# EAGLE design sensor-t (EAGLE 6.2)
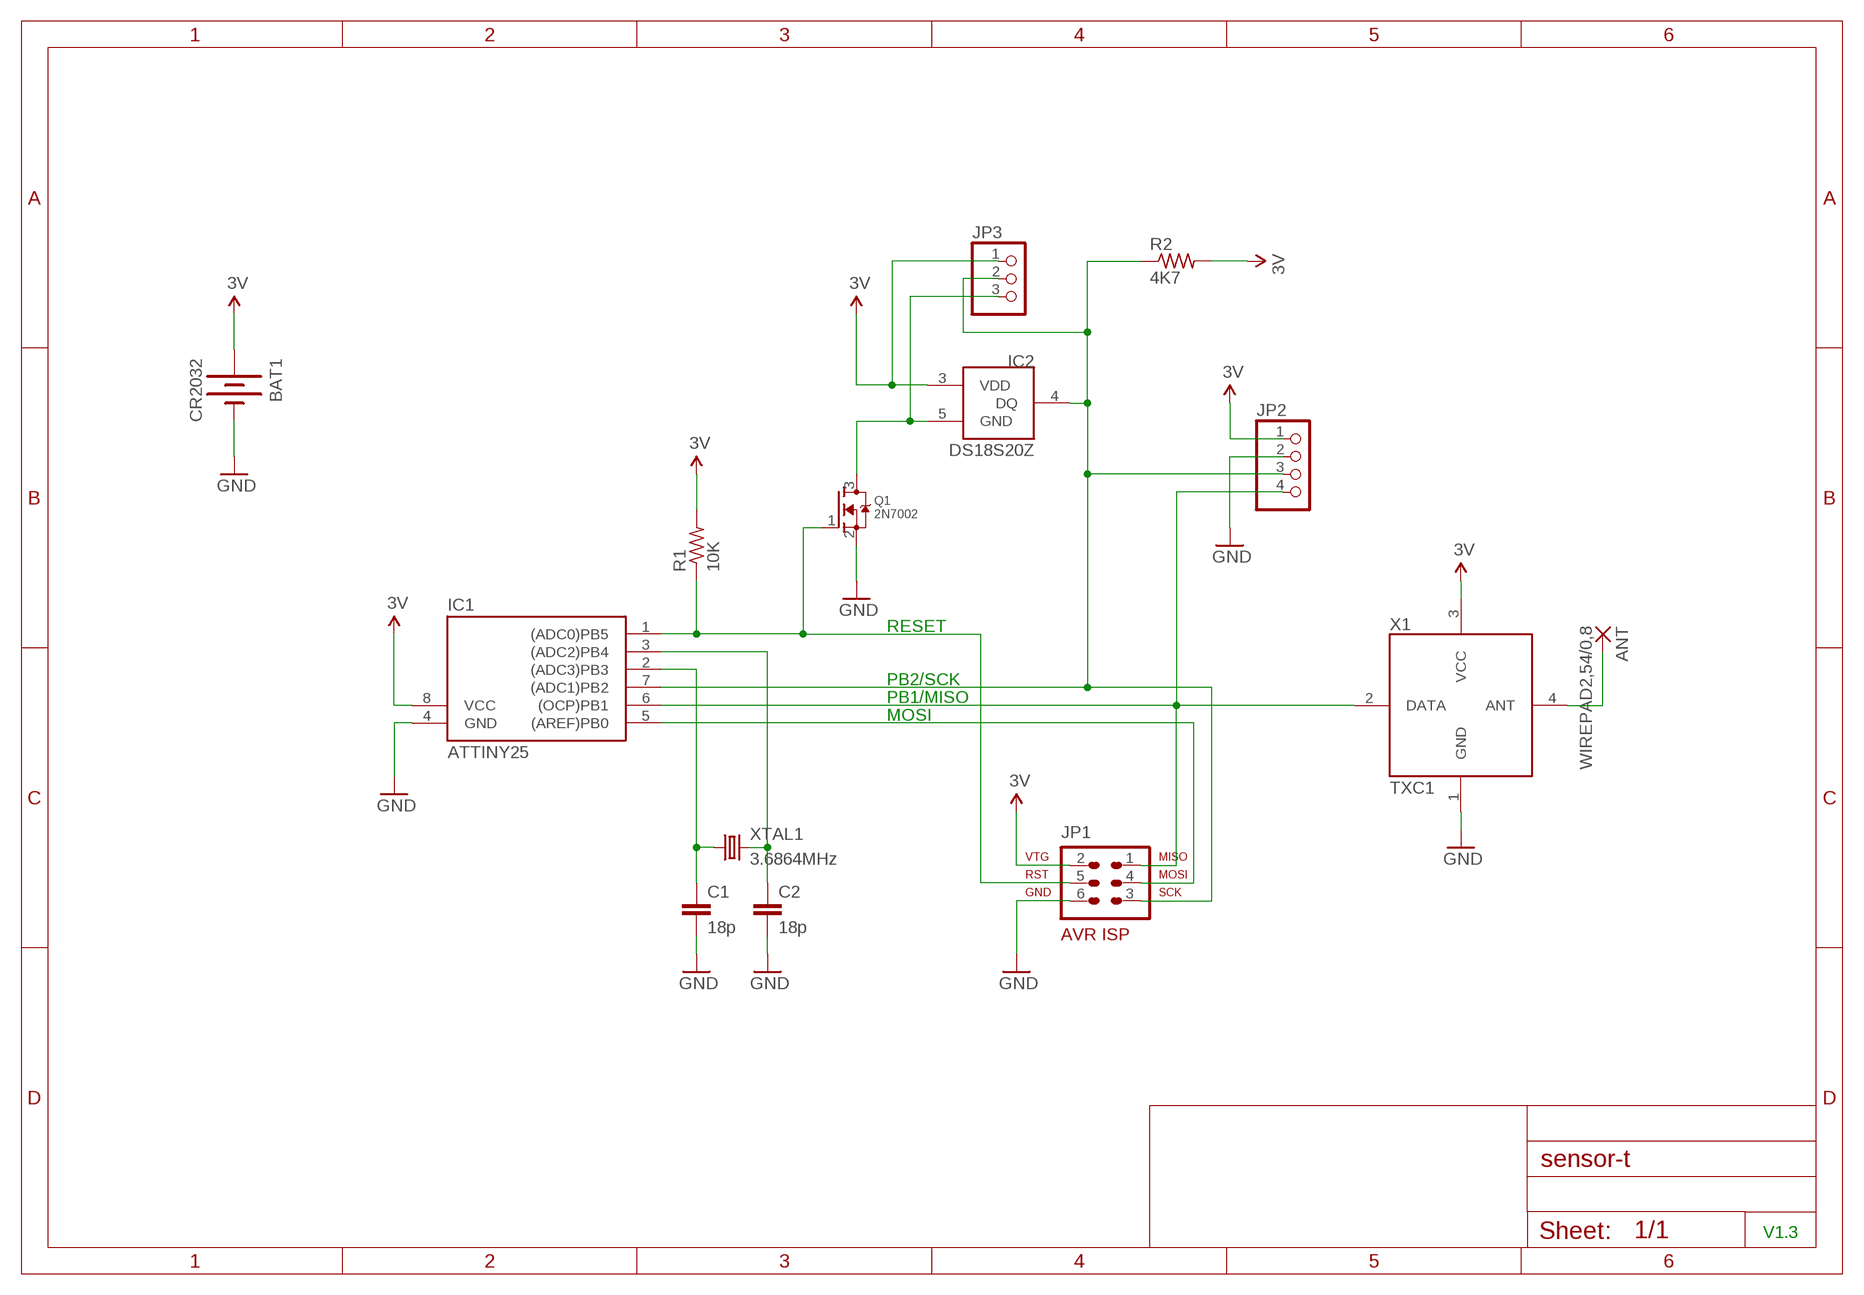
[diagram p0: schematic, sheet 1]

## Parts
ANT  WIREPAD2,54/0,8  [2,54/0,8]
BAT1  CR2032  BATTERY  [BATTCON_CELL_20MM]
C1  18p  CAP0805  [0805]
C2  18p  CAP0805  [0805]
IC1  ATTINY25  TINY25-20SU  [SOIC8]
IC2  DS18S20Z  [SO08-208]
JP1  AVR-ISP-6X1  [1X06]
JP2  PINHD-1X4  [1X04]
JP3  PINHD-1X3  [1X03]
Q1  2N7002  MOSFET-NREFLOW  [SOT23]
R1  10K  R-US_M0805  [M0805]
R2  4K7  R-US_M0805  [M0805]
X1  TXC1  [TXC1]
XTAL1  3.6864MHz  CRYSTALSMD  [HC49UP]

## Nets
3.3V: BAT1.+VE(+) IC1.8(VCC) IC2.3(VDD) JP1.2 JP2.1 JP3.1 R1.2 R2.2 X1.3(VCC) ; supply symbol labelled 3V
GND: BAT1.-VE(-) C1.2 C2.2 IC1.4(GND) JP1.6 JP2.2 Q1.2(S) X1.1(GND)
N$2: IC1.6((OCP)PB1) JP1.1 JP2.4 X1.2(DATA)
N$3: IC1.5((AREF)PB0) JP1.4
N$4: ANT.1(P) X1.4(ANT)
N$5: IC1.1((ADC0)PB5) JP1.5 Q1.1(G) R1.1
N$6: C1.1 IC1.2((ADC3)PB3) XTAL1.1
N$7: C2.1 IC1.3((ADC2)PB4) XTAL1.2
N$8: IC1.7((ADC1)PB2) IC2.4(DQ) JP1.3 JP2.3 JP3.2 R2.1
N$9: IC2.5(GND) JP3.3 Q1.3(D)

## Notes on the sheet
- RESET
- PB2/SCK
- PB1/MISO
- MOSI
- V1.3

## Library data of the parts
ANT = wirepad:WIREPAD: Wire PAD connect wire on PCB
BAT1 = 00-rolfe:BATTERY: Battery Holders Various common sizes : AA, AAA, 20mm coin cell and 12mm coin cell.
C1 C2 = SparkFun-2-20-08:CAP: Capacitor Standard 0603 ceramic capacitor, and 0.1" leaded capacitor.
IC1 = avr-4:TINY25
IC2 = rolfe:DS18S20: Temperature Sensor, 1-wire
JP1 = rolfe:AVR-ISP-6: AVR ISP-6 Serial Programming Header
JP2 = pinhead:PINHD-1X4: PIN HEADER
JP3 = pinhead:PINHD-1X3: PIN HEADER
Q1 = adafruit:MOSFET-N: N-Channel Mosfet 2N7002E - 60V 260mA SOT23 [Digikey: 2N7002ET1GOSTR-ND] - REEL BSH103 - 30V 850mA SOT23 [Digikey: 568-5013-1-ND]
R1 R2 = rcl:R-US_: RESISTOR, American symbol
X1 = 00-rolfe:TXC1
XTAL1 = SparkFun-2-20-08:CRYSTAL: Crystals Various standard crystals. Proven footprints. Spark Fun Electronics SKU : COM-00534

## Board
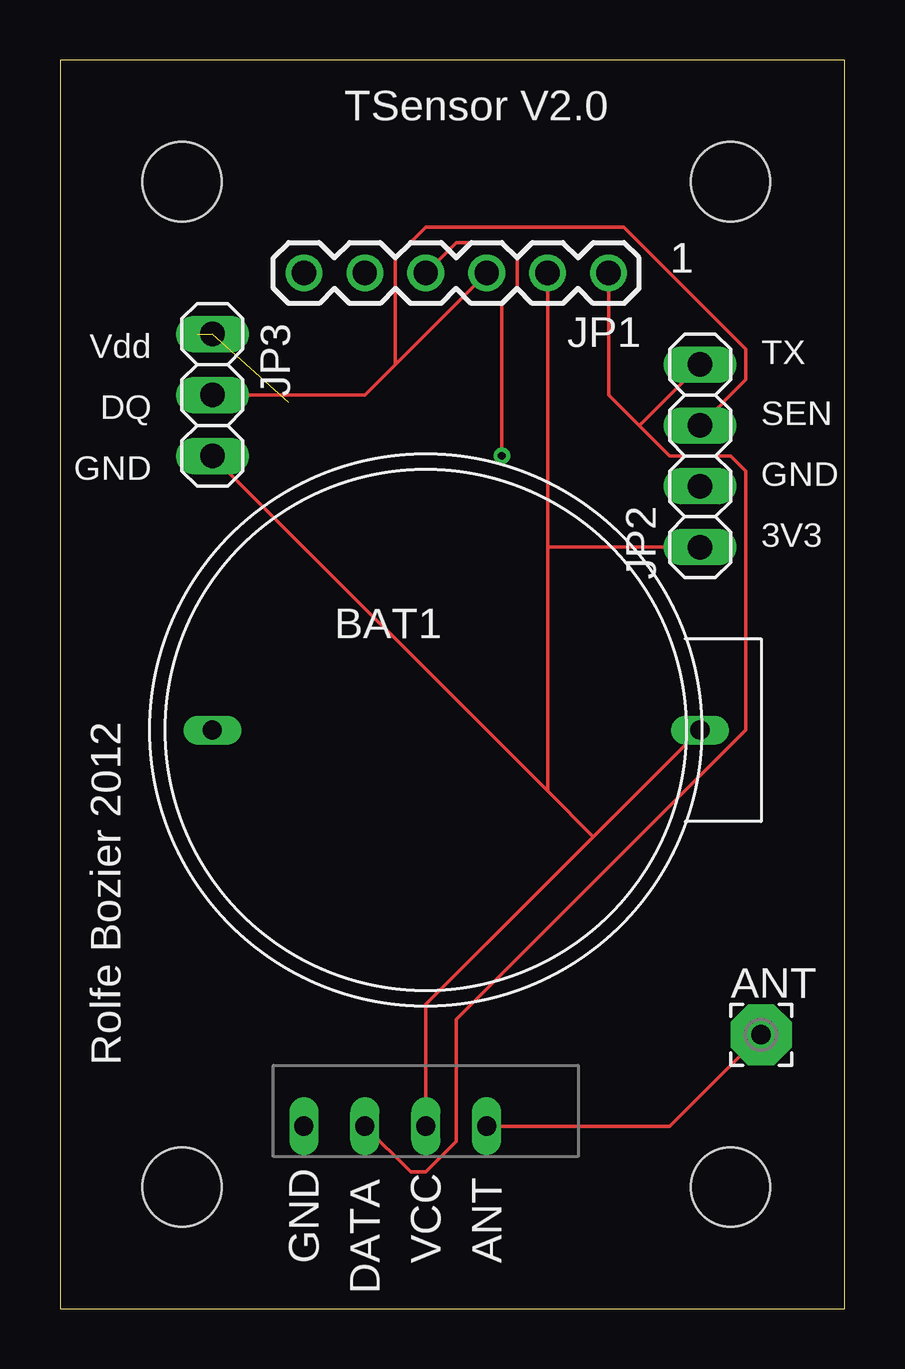
[diagram p1: board, top side]
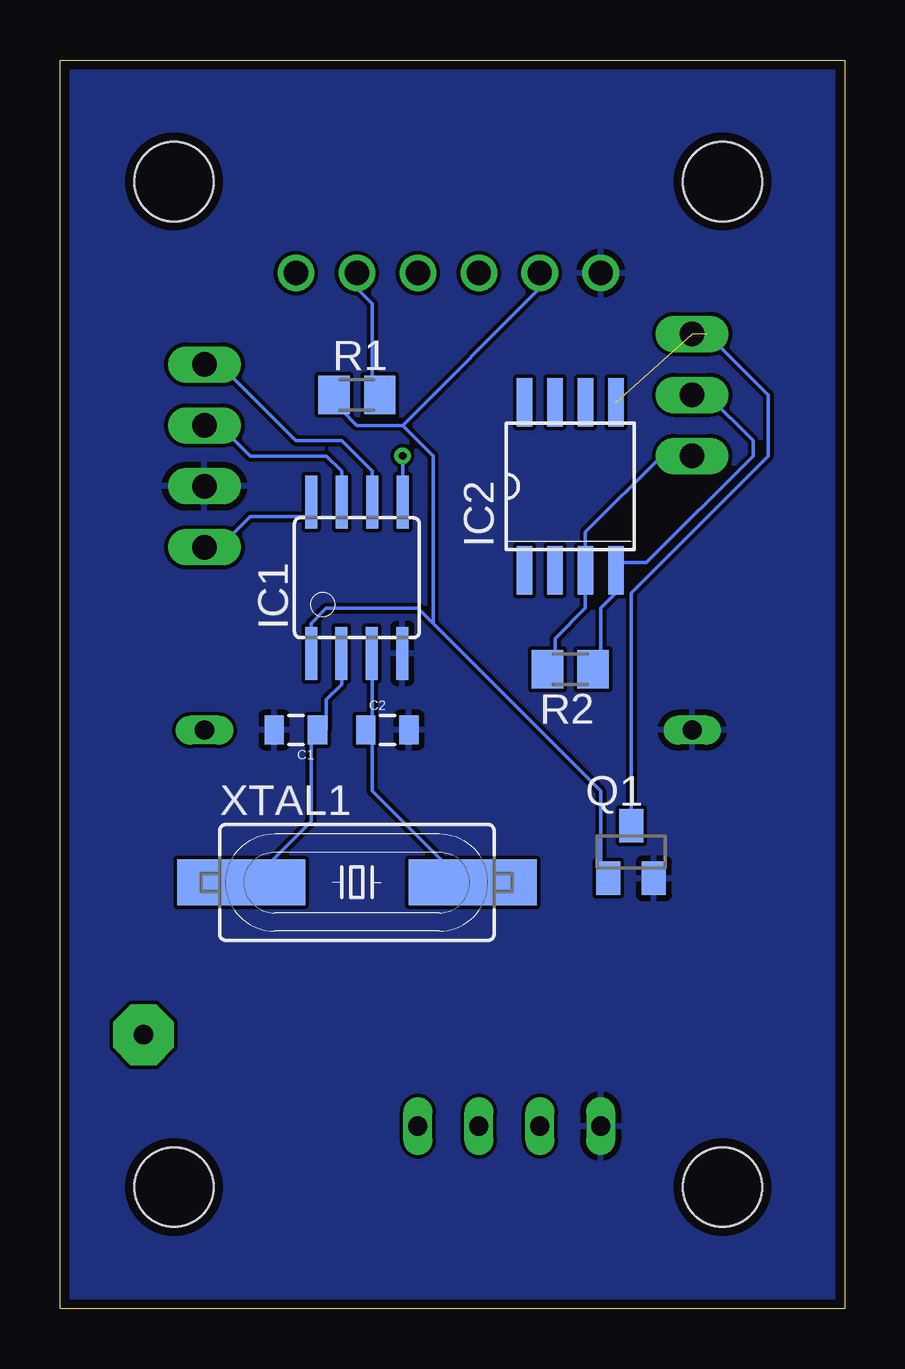
[diagram p2: board, bottom side, seen from below]

Size 32.69 x 52.06 mm. Coordinates in mm from the lower left corner, seen from the top.
Outline: 0,0 32.69,0 32.69,52.06 0,52.06 0,0
Copper layers (1*16): Top 0.0356mm / dielectric 1.5011mm / Bottom 0.0356mm
Design rules: minimum track width 6mil, minimum drill 13mil, track to track 6mil, track to pad 6mil, pad to pad 6mil, via to via 6mil, smd to smd 6mil, copper to edge 15mil, drill to drill 6mil, minimum pad ring 7mil, minimum via ring 7mil, stop-mask expansion 4mil, vias tented up to drill 0mil, thermal gap 10mil

### Footprints (pad centres in the part's own frame; a part is rotated, then mirrored left to right if it is on the bottom)
2,54/0,8 = drill 0.813 pad 2.54 octagon: 1 0,0
BATTCON_CELL_20MM = drill 0.8 long: +VE 11.43,0; -VE -8.89,0
0805 = smd 0.8 x 1.2: 1 -0.9,0; 2 0.9,0
SOIC8 = smd 0.5 x 2.2: 1 -1.905,-3.154; 2 -0.645,-3.154; 3 0.625,-3.154; 4 1.895,-3.154; 5 1.905,3.154; 6 0.635,3.154; 7 -0.635,3.154; 8 -1.905,3.154
SO08-208 = smd 0.66 x 2.032: 1 -1.905,-3.498; 2 -0.635,-3.498; 3 0.635,-3.498; 4 1.905,-3.498; 5 1.905,3.498; 6 0.635,3.498; 7 -0.635,3.498; 8 -1.905,3.498
1X06 = drill 1.016: 1 0,0; 2 2.54,0; 3 5.08,0; 4 7.62,0; 5 10.16,0; 6 12.7,0
1X04 = drill 1.016 long: 1 -3.81,0; 2 -1.27,0; 3 1.27,0; 4 3.81,0
1X03 = drill 1.016 long: 1 -2.54,0; 2 0,0; 3 2.54,0
SOT23 = smd 1 x 1.4: 1 -0.95,-1.1; 2 0.95,-1.1; 3 0,1.1
M0805 = smd 1.3 x 1.6: 1 -0.95,0; 2 0.95,0
STAND-OFF = hole 3.302: 0,0
TXC1 = drill 0.8 long: 1 -3.81,0; 2 -1.27,0; 3 1.27,0; 4 3.81,0
HC49UP = smd 5.334 x 1.93: 1 -4.826,0; 2 4.826,0

### Placement (x,y rotation side)
ANT  29.21,11.43 0 top
BAT1  15.24,24.13 0 top
C1  22.86,24.13 180 bottom
C2  19.05,24.13 0 bottom
IC1  20.32,30.48 0 bottom
IC2  11.43,34.29 0 bottom
JP1  22.86,43.18 180 top
JP2  26.67,35.56 90 top
JP3  6.35,38.1 90 top
Q1  8.89,19.05 0 bottom
R1  20.32,38.1 0 bottom
R2  11.43,26.67 180 bottom
U$1  [STAND-OFF]  5.08,5.08 0 top
U$2  [STAND-OFF]  27.94,5.08 0 top
U$3  [STAND-OFF]  27.94,46.99 0 top
U$4  [STAND-OFF]  5.08,46.99 0 top
X1  13.97,7.62 0 top
XTAL1  20.32,17.78 0 bottom

### Tracks (layer width: path | path; a pad name or v marks a point on that pad's centre or on a via)
3.3V
  Top 0.152: X1.3 15.24,12.7 22.23,19.68 | BAT1.+VE 22.23,19.68 | 22.23,19.68 20.32,21.59 | 20.32,21.59 JP3.1 | 20.32,21.59 20.32,31.75 | 20.32,31.75 JP1.2 | 20.32,31.75 JP2.1
  Bottom 0.152: JP2.1 26.04,31.75 24.77,33.02 22.23,33.02 IC1.8 | JP1.2 20.32,42.55 19.68,41.91 19.68,38.1 R1.2 | R2.2 12.06,26.67 12.06,27.94 10.79,29.21 IC2.3 10.79,32.38 7.62,35.56 JP3.1
GND
  pour Bottom: 0,52.07 33.02,52.07 33.02,0 0,0
N$2
  Top 0.152: X1.2 14.61,5.71 15.24,5.71 16.51,6.99 16.51,12.06 28.57,24.13 28.57,34.92 27.94,35.56 25.4,35.56 24.13,36.83 | 24.13,36.83 22.86,38.1 JP1.1 | 24.13,36.83 JP2.4
  Bottom 0.152: IC1.6 19.68,34.92 20.95,36.2 22.86,36.2 26.04,39.37 JP2.4
N$3  (via drill 0.33)
  Top 0.152: v18.41,35.56 18.41,41.91 19.05,42.55 19.05,43.81 18.41,44.45 16.51,44.45 JP1.4
  Bottom 0.152: v18.41,35.56 IC1.5
N$4
  Top 0.152: X1.4 25.4,7.62 ANT.1
N$5
  Bottom 0.152: 18.41,36.83 20.32,36.83 20.95,37.47 20.95,38.1 R1.1 | 18.41,36.83 12.7,42.55 JP1.5 | 17.14,28.57 17.78,29.21 21.59,29.21 22.23,28.57 IC1.1 | 17.14,28.57 10.16,21.59 10.16,18.41 Q1.1 | 18.41,36.83 17.14,35.56 17.14,28.57
N$6
  Bottom 0.152: IC1.2 20.95,27.3 20.95,26.04 21.59,25.4 21.59,24.13 C1.1 22.23,24.13 22.23,20.32 24.77,17.78 XTAL1.1
N$7
  Bottom 0.152: 19.68,24.13 19.68,27.3 IC1.3 | 19.68,24.13 19.68,21.59 15.88,17.78 XTAL1.2 | 19.68,24.13 C2.1
N$8
  Top 0.152: JP3.2 12.7,38.1 13.97,39.37 | JP1.3 13.97,39.37 | JP2.3 28.57,38.73 28.57,40.01 23.5,45.09 15.24,45.09 13.97,43.81 13.97,39.37
  Bottom 0.152: IC1.7 20.95,34.92 21.59,35.56 24.77,35.56 26.04,36.83 JP2.3 | R2.1 10.16,26.67 10.16,29.21 9.53,29.84 IC2.4 9.53,31.11 8.26,31.11 3.81,35.56 3.81,36.2 5.71,38.1 JP3.2
N$9  (2 unrouted)
  Bottom 0.152: Q1.3 8.89,29.84 3.17,35.56 3.17,38.1 5.71,40.64

### Text on the board
tNames: TSensor V2.0 | Vdd | TX | DQ | SEN | GND | GND | 3V3 | Rolfe Bozier 2012